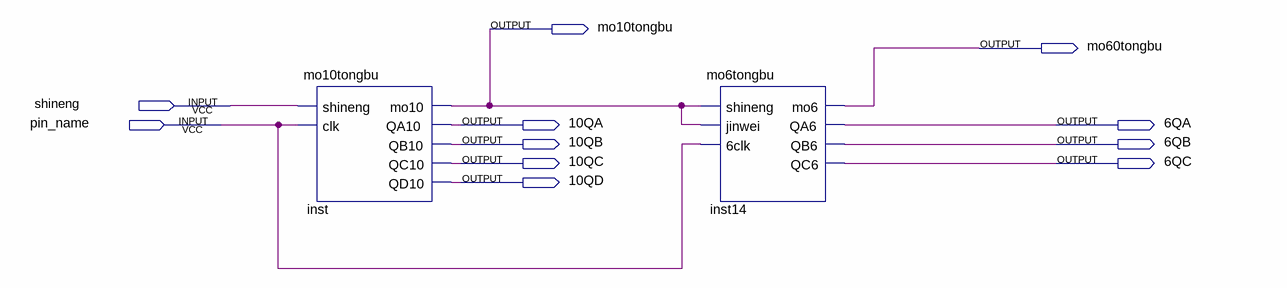
[diagram p0: schematic sheet]
// Quartus schematic mo60tongbu.bdf as structural Verilog: 2 symbols, 11 pins
module mo60tongbu (
  input  shineng,
  input  pin_name,
  output mo10tongbu,
  output mo60tongbu,
  output \10QA ,
  output \6QA ,
  output \10QB ,
  output \6QB ,
  output \10QC ,
  output \6QC ,
  output \10QD 
);

  mo10tongbu inst (
    .shineng(shineng), .clk(pin_name), .mo10(mo10tongbu), .QA10(\10QA ), .QB10(\10QB ), .QC10(\10QC ),
    .QD10(\10QD ));
  mo6tongbu inst14 (
    .shineng(mo10tongbu), .jinwei(mo10tongbu), .\6clk (pin_name), .mo6(mo60tongbu), .QA6(\6QA ), .QB6(\6QB ),
    .QC6(\6QC ));
endmodule
